# EAGLE design boost gauge (2) V1.2 (EAGLE 5.07)
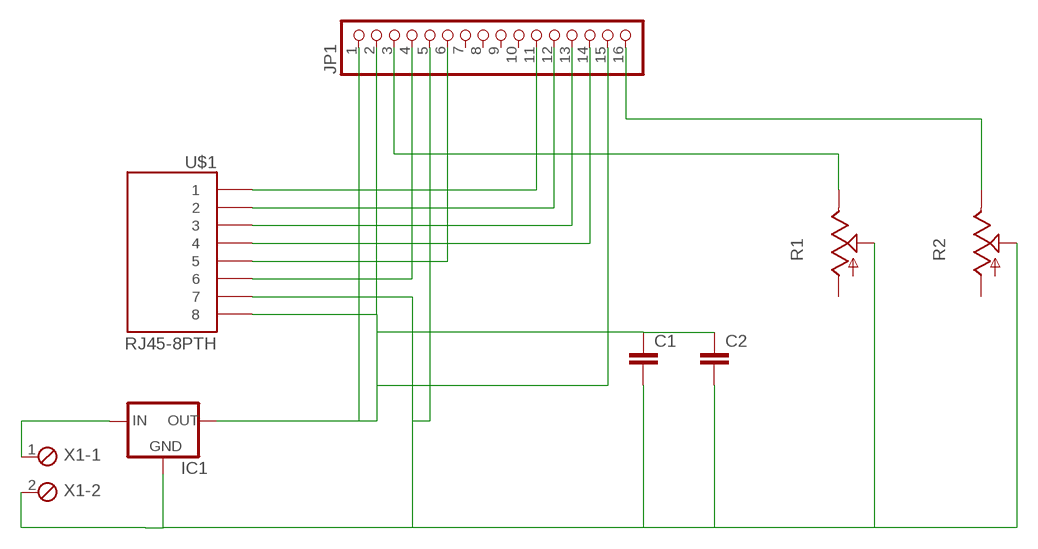
[diagram p0: schematic, sheet 1]

## Parts
C1  CAPPTH  [CAP-PTH-SMALL]
C2  CAPPTH  [CAP-PTH-SMALL]
IC1  78XXS  [78XXS]
JP1  PINHD-1X16  [1X16]
R1  TRIM_US-B25X  [B25X]
R2  TRIM_US-B25X  [B25X]
U$1  RJ45-8PTH  [RJ45-8]
X1  MPT2  [2POL254]

## Nets
N$1: JP1.11 U$1.1
N$2: JP1.12 U$1.2
N$3: JP1.13 U$1.3
N$4: JP1.14 U$1.4
N$5: JP1.6 U$1.5
N$6: JP1.4 U$1.6
N$7: IC1.GND JP1.5 U$1.7 X1.2
N$8: IC1.IN X1.1
N$9: JP1.16 R2.E
N$10: JP1.3 R1.E
N$11: C1.2 C2.2 R1.S R2.S
N$12: C1.1 C2.1 IC1.OUT JP1.1 JP1.2 JP1.15 U$1.8
Unconnected: JP1.7 JP1.8 JP1.9 JP1.10 R1.A R2.A

## Library data of the parts
C1 C2 = SparkFun:CAP: Capacitor Standard 0603 ceramic capacitor, and 0.1" leaded capacitor.
IC1 = v-reg:78XXS: VOLTAGE REGULATOR
JP1 = pinhead:PINHD-1X16: PIN HEADER
R1 R2 = pot:TRIM_US-: POTENTIOMETER
U$1 = SparkFun:RJ45-8: RJ45 Jack Simple RJ45, 8-pin connection - connector for common Cat5, Cat5e, and Cat6 Ethernet cables. Footprint not yet proven in production. Connector sku is PRT-00643; Breakout PCB sku is BOB-00716.
X1 = con-phoenix-254:MPT2: PHOENIX CONNECTOR

## Board
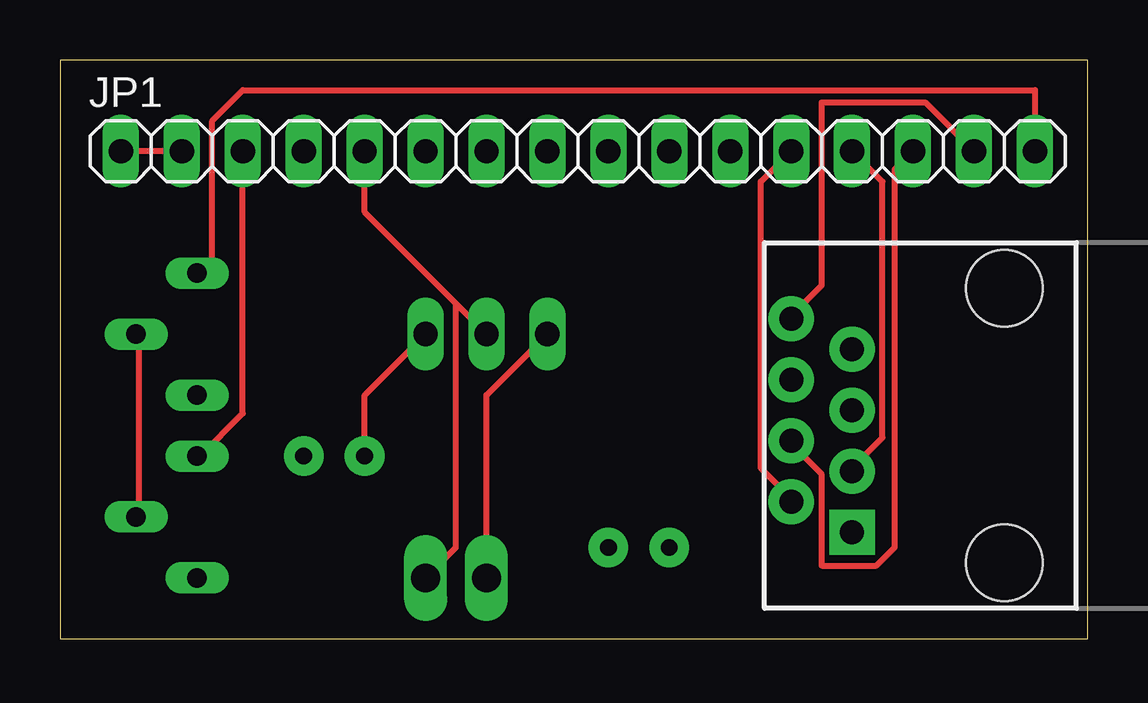
[diagram p1: board, top side]
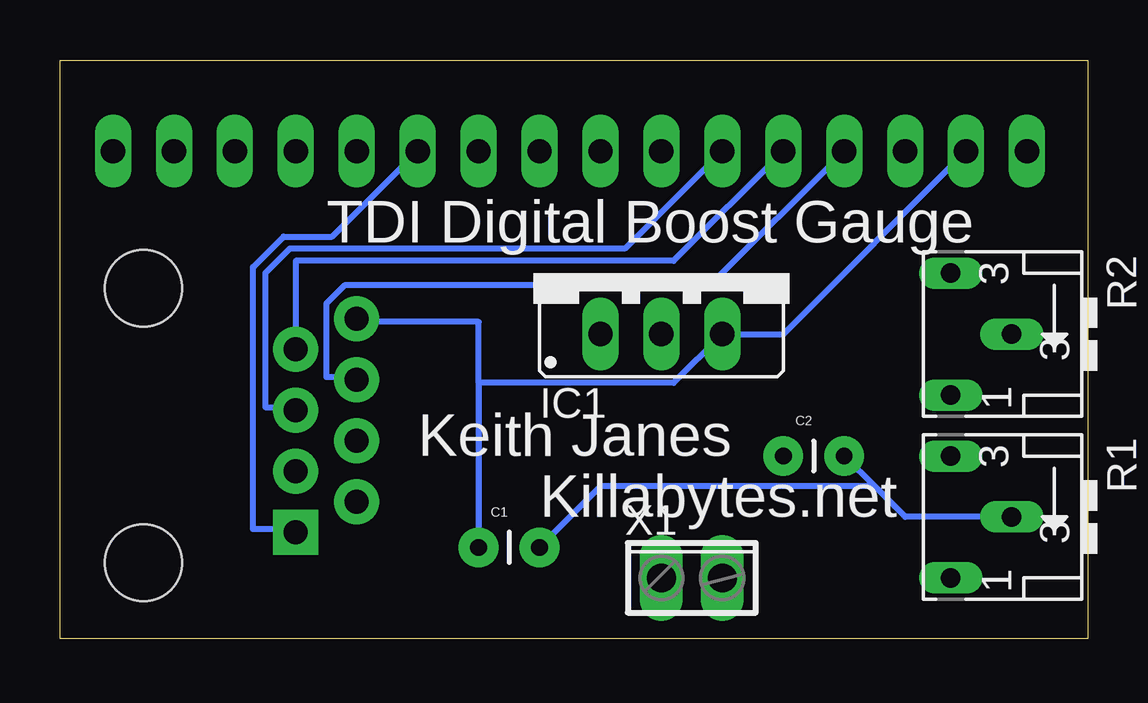
[diagram p2: board, bottom side, seen from below]

Size 42.85 x 24.12 mm. Coordinates in mm from the lower left corner, seen from the top.
Outline: 0,0 42.85,0 42.85,24.12 0,24.12 0,0
Copper layers (1*16): Top 0.035mm / dielectric 1.5mm / Bottom 0.035mm
Design rules "default": minimum track width 10mil, minimum drill 24mil, track to track 8mil, track to pad 8mil, pad to pad 8mil, via to via 8mil, smd to smd 8mil, copper to edge 40mil, drill to drill 8mil, minimum pad ring 10mil, minimum via ring 8mil, stop-mask expansion 4mil, vias tented up to drill 0mil, thermal gap 10mil

### Footprints (pad centres in the part's own frame; a part is rotated, then mirrored left to right if it is on the bottom)
CAP-PTH-SMALL = drill 0.7 pad 1.651 round: 1 0,0; 2 2.54,0
78XXS = drill 1.016 long: GND 0,-2.54; IN -2.54,-2.54; OUT 2.54,-2.54
1X16 = drill 1.016 long: 1 -19.05,0; 2 -16.51,0; 3 -13.97,0; 4 -11.43,0; 5 -8.89,0; 6 -6.35,0; 7 -3.81,0; 8 -1.27,0; 9 1.27,0; 10 3.81,0; 11 6.35,0; 12 8.89,0; 13 11.43,0; 14 13.97,0; 15 16.51,0; 16 19.05,0
B25X = drill 0.813 long: A 2.54,-1.905; E -2.54,-1.905; S 0,0.635
RJ45-8 = drill 1 pad 1.88 square: 1 -4.445,6.35 | drill 1 pad 1.88 round: 2 -3.175,8.89; 3 -1.905,6.35; 4 -0.635,8.89; 5 0.635,6.35; 6 1.905,8.89; 7 3.175,6.35; 8 4.445,8.89 | hole 3.2: -5.715,0; 5.715,0
2POL254 = drill 1.2 long: 1 -1.27,0; 2 1.27,0

### Placement (x,y rotation side)
C1  25.4,3.81 0 bottom
C2  12.7,7.62 0 bottom
IC1  17.78,15.24 0 bottom
JP1  21.59,20.32 0 top
R1  3.81,5.08 270 bottom
R2  3.81,12.7 270 bottom
U$1  39.37,8.89 90 top
X1  16.51,2.54 0 bottom

### Tracks (layer width: path | path; a pad name or v marks a point on that pad's centre or on a via)
N$1
  Bottom 0.254: JP1.11 31.5,16.76 33.53,16.76 34.8,15.49 34.8,4.57 33.02,4.57 U$1.1
N$2
  Top 0.254: JP1.12 29.21,19.05 29.21,7.11 30.48,5.84 U$1.2
N$3
  Top 0.254: JP1.13 34.29,19.05 34.29,8.38 33.02,7.11 U$1.3
N$4
  Top 0.254: JP1.14 34.8,19.56 34.8,3.81 34.04,3.05 31.75,3.05 31.75,6.86 30.48,8.13 U$1.4
N$5
  Bottom 0.254: JP1.6 19.3,16.26 33.27,16.26 34.29,15.24 34.29,9.65 33.02,9.65 U$1.5
N$6
  Bottom 0.254: JP1.4 15.75,14.73 30.99,14.73 31.75,13.97 31.75,10.92 30.48,10.92 U$1.6
N$7
  Top 0.254: 16.51,13.97 12.7,17.78 JP1.5 | 16.51,13.97 IC1.GND | X1.2 16.51,3.81 16.51,13.97
  Bottom 0.254: JP1.5 17.27,15.75 33.02,15.75 U$1.7
N$8
  Top 0.254: IC1.IN 17.78,10.16 X1.1
N$9
  Top 0.254: JP1.16 40.64,22.86 7.62,22.86 6.35,21.59 6.35,15.75 5.84,15.24 R2.E
N$10
  Top 0.254: JP1.3 7.62,9.4 5.84,7.62 R1.E
N$11
  Top 0.254: R1.S 3.3,5.08 3.3,12.7 R2.S
  Bottom 0.254: 8.89,6.35 7.62,5.08 R1.S | 8.89,6.35 C2.2 | C1.2 20.32,6.35 8.89,6.35
N$12
  Top 0.254: JP1.2 JP1.1 | IC1.OUT 12.7,10.16 C2.1 | JP1.15 36.07,22.35 31.75,22.35 31.75,14.73 30.48,13.46 U$1.8
  Bottom 0.254: JP1.2 12.7,12.7 IC1.OUT 17.27,10.67 25.4,10.67 | 25.4,10.67 25.4,13.21 30.48,13.21 U$1.8 | 25.4,10.67 C1.1

### Text on the board
bNames: TDI Digital Boost Gauge | Keith Janes | Killabytes.net